# Altium schematic sheet Buzzer.SchDoc
size A
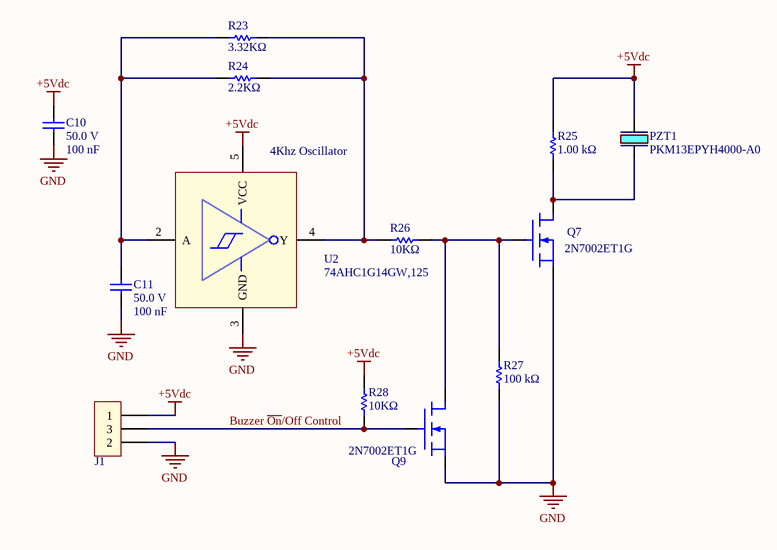
[diagram p0: Buzzer.SchDoc]

## Parts
C10  Voltage Rating (DC): 50.0 V  Capacitance: 100 nF  [Cap,0805]  (hidden comment: 08055C104JAT2A)
C11  Voltage Rating (DC): 50.0 V  Capacitance: 100 nF  [Cap,0805]  (hidden comment: 08055C104JAT2A)
J1  Generic Header  [Header,3POS,0.1",RA]  (value not drawn)
PZT1  PKM13EPYH4000-A0  [Buzzer,PKM13EPYH4000-A0]
Q7  2N7002ET1G  [SOT23-3]
Q9  2N7002ET1G  [SOT23-3]
R23  Resistance: 3.32KΩ  [res, 0805, HD]  (hidden comment: CRCW08053K32FKEA)
R24  Resistance: 2.2KΩ  [res, 0805, HD]  (hidden comment: CRCW08052K20FKEA)
R25  Resistance: 1.00 kΩ  [res, 0805, HD]  (hidden comment: Vishay CRCW08051K00JNEA)
R26  Resistance: 10KΩ  [res, 0805, HD]  (hidden comment: Vishay / Dale CRCW080510K0FKTA)
R27  Resistance: 100 kΩ  [res, 0805, HD]  (hidden comment: CRCW0805100KFKEA)
R28  Resistance: 10KΩ  [res, 0805, HD]  (hidden comment: Vishay / Dale CRCW080510K0FKTA)
U2  74AHC1G14GW,125  [SOT23-5]

## Nets
+5Vdc: C10.2 J1.1 PZT1.2 R25.1 R28.1 U2.5(VCC)
GND: C10.1 C11.2 J1.2 Q7.2(S) Q9.2(S) R27.2 U2.3(GND)
Buzzer ~{On}/Off Control: J1.3 Q9.1(G) R28.2
NetC11_1: C11.1 R23.2 R24.2 U2.2(A)
NetPZT1_1: PZT1.1 Q7.3(D) R25.2
NetQ7_1: Q7.1(G) Q9.3(D) R26.1 R27.1
NetR23_1: R23.1 R24.1 R26.2 U2.4(Y)

Not connected (* = marked no-connect by the designer): U2 1(N/C)

## Notes on the sheet
- (near U2) 4Khz Oscillator

## Library data of the parts
C10 C11 = Cap,0805,100nf,50V,5%,08055C104JAT2A: Capacitor; Ceramic; Cap 0.1 uF; Tol 5%; Vol-Rtg 50 VDC; SMT; 0805; X7R; Tape & Reel; Lead-Free Status: Lead Free; Case/Package (SI): 2012; Insulation Resistance: 100 GΩ; Detailed Description: 0.1µF ±5% 50V Ceramic Capacitor X7R 0805 (2012 Metric); Mounting Style: Surface Mount; Packaging: Tape & Reel (TR), Cut Tape (CT); RoHS: Compliant; Size-Width: 1.24 mm; Case/Package: 0805; Number of Pins: 2; digikey url: http://www.digikey.ca/product-detail/en/avx-corporation/08055C104JAT2A/478-3352-1-ND/930144; REACH SVHC Compliance: No SVHC; Dielectric Characteristic: X7R; Capacitance Tolerance: ±5%; Size-Length: 2.01 mm; Size-Height: 710 µm; Size-Thickness: 940 µm; Manufacturer Part Number: 08055C104JAT2A; Octopart URL: http://octopart.com/08055c104jat2a-avx-55388010; Operating Temperature: -55°C ~ 125°C; Supplier 1: Digi-Key; Supplier Part Number 1: 478-3352-1-ND
J1 = Header 1x3,0.1",TH,Generic: Generic Header 3 pos header 0.1"
PZT1 = Buzzer,PIEZO,30V,TH,4Khz,PKM13EPYH4000-A0: AUDIO PIEZO TRANSDUCER 30V TH; Manufacturer: Murata Electronics; Detailed Description: Buzzers Transducer, Externally Driven Piezo 1.5 V - 4kHz 70dB @ 1.5V, 10cm Through Hole PC Pins; Driver Circuitry: Transducer, Externally Driven; Input Type: Zero-Peak Signal; Voltage Range: 30V (Max); Frequency: 4kHz; Operating Mode: Ringer; Sound Pressure Level (SPL): 70dB @ 1.5V, 10cm; Port Location: Top; Voltage - Rated: 1.5 V; mfg P/N: PKM13EPYH4000-A0; Category: Audio Products  Alarms, Buzzers, and Sirens; Series: PK; Part Status: Active; Technology: Piezo; Operating Temperature: -40°C ~ 85°C; Mounting Type: Through Hole; Termination: PC Pins; Size / Dimension: 0.496" Dia (12.60mm); Height - Seated (Max): 0.291" (7.40mm); Base Product Number: PKM13EPY; Supplier 1: Mouser; Supplier Part Number 1: 81-PKM13EPYH4000-A0; Supplier 2: Arrow Electronics; Supplier Part Number 2: PKM13EPYH4000-A0; Supplier 3: Digi-Key; Supplier Part Number 3: 490-4698-1-ND
Q7 Q9 = MOSFET,N-Channel,SOT23,0.25A,60V,2N7002ET1G: Small Signal MOSFET, 60 V, 310 mA, Single, N-Channel, 3-Pin SOT-23, Pb-Free, Tape and Reel; Manufacturer: ON Semiconductor; Continuous Drain Current (Ids): 0.25A; Lead-Free Status: Lead Free; Drain to Source Voltage (Vds): 60.0 V; Power Dissipation (Max): 350mW (Ta); REACH SVHC Compliance: No SVHC; Number of Pins: 3; Halogen Free Status: Halogen Free; Case/Package: SOT-23-3; Polarity: N-Channel; RoHS: Compliant; Lifecycle Status: Active; Supplier 1: Digi-Key; Supplier Part Number 1: 2N7002ET1GOSCT-ND; Supplier 2: LCSC; Supplier Part Number 2: C71533; Manufacturer Part Number: 2N7002ET1G
R23 = Res,0805,3.32K,±1%,100.0 ppm/°C,150.0 V,CRCW08053K32FKEA: RES SMD 3.32K OHM 1% 1/8W 0805; Case/Package (SI): 2012; Lead-Free Status: Lead Free; Power Rating: 0.125 W; Voltage Rating (DC): 150.0 V; Case/Package: 0805; Mounting Style: Surface Mount; Number of Pins: 2; REACH SVHC Compliance: No SVHC; Resistance Tolerance: ±1%; RoHS: Compliant; Size-Height: 0.00045 m; Size-Length: 0.002 m; Size-Width: 0.00125 m; Temperature Coefficient: 100.0 ppm/°C; mfg P/N: CRCW08053K32FKEA; Supplier 1: Digi-Key; Supplier Part Number 1: 541-3.32KCCT-ND
R24 = Res,0805,2.2KΩ,±1%,100.0 ppm/°C,150.0 V,CRCW08052K20FKEA: RES SMD 2.2K OHM 1% 1/8W 0805; Case/Package (SI): 2012; Lead-Free Status: Lead Free; Power Rating: 0.125 W; Voltage Rating (DC): 150.0 V; Case/Package: 0805; Mounting Style: Surface Mount; Number of Pins: 2; REACH SVHC Compliance: No SVHC; Resistance Tolerance: ±1%; RoHS: Compliant; Size-Height: 0.00045 m; Size-Length: 0.002 m; Size-Width: 0.00125 m; Temperature Coefficient: 100.0 ppm/°C; mfg P/N: CRCW08052K20FKEA; Supplier 1: Digi-Key; Supplier Part Number 1: 541-2.20KCCT-ND
R25 = Res,0805,1.00 kΩ,5%,200ppm,CRCW08051K00JNEA: Res Thick Film 0805 1K Ohm 5% 0.125W(1/8W) ±200ppm/C Molded SMD Automotive Paper T/R; Power Rating: 125 mW; Case/Package (SI): 2012; Lead-Free Status: Lead Free; Temperature Coefficient: 200 ppm/°C; Voltage Rating (DC): 150 V; Size-Width: 1.25 mm; Mounting Style: Surface Mount; REACH SVHC Compliance: No SVHC; Manufacturer Part Number: CRCW08051K00JNEA; Number of Pins: 2; Size-Height: 450 µm; Packaging: Tape & Reel (TR), Cut Tape (CT); RoHS: Compliant; Resistance Tolerance: ±5%; Case/Package: 0805; Size-Length: 2.00 mm; Supplier 1: Digi-Key; Supplier Part Number 1: 541-1.0KADKR-ND; Supplier 2: Digi-Key; Supplier Part Number 2: 541-1.0KACT-ND
R26 R28 = Res,0805,10.0kΩ,1%,100 ppm,CRCW080510K0FKTA: RES SMD 10K OHM 1% 1/8W 0805; Temperature Coefficient: 100.0 ppm/C; Lead-Free Status: Contains Lead; Voltage Rating (DC): 150.0 V; Power Rating: 0.125 W; Case/Package (SI): 2012; Size-Width: 0.00125 m; Resistance Tolerance: 1%; Size-Length: 0.002 m; RoHS: Non-Compliant; Power Dissipation: 0.125 W; Number of Pins: 2; REACH SVHC Compliance: No SVHC; Size-Height: 0.00045 m; Case/Package: 0805; Mounting Style: Surface Mount; Supplier 1: Digi-Key; Supplier Part Number 1: 541-3016-1-ND
R27 = Res,0805,100kΩ,1%,100ppm,CRCW0805100KFKEA: 100 kOhms ±1% 0.125W, 1/8W Chip Resistor 0805 (2012 Metric) Thick Film; Manufacturer: Vishay; Lead-Free Status: Lead Free; Case/Package (SI): 2012; Power Rating: 125 mW; Temperature Coefficient: -100 ppm/°C to 100 ppm/°C; Resistance Tolerance: ±1%; RoHS: Compliant; Manufacturer Part Number: CRCW0805100KFKEA; Number of Pins: 2; Size-Length: 2.00 mm; Packaging: Tape & Reel (TR), Reel, Cut Tape (CT); Size-Height: 450 µm; Case/Package: 0805; Size-Width: 1.25 mm; Operating Temperature: 150 °C (max); Supplier 1 Part Number: 679-0803; Supplier 1: RS; Supplier 2: Digi-Key; Supplier Part Number 2: 541-100KCCT-ND
U2 = IC,Logic,Schmitt trigger INV,2V ~ 5.5V,5-TSSOP , 74AHC1G14GW,125: IC INVERTER SCHMITT 1CH 5TSSOP; Manufacturer: Nexperia USA Inc.; Detailed Description: Inverter IC 1 Channel Schmitt Trigger 5-TSSOP; Number of Inputs: 1; Current - Output High, Low: 8mA, 8mA; Logic Level - Low: 0.9V ~ 1.65V; Logic Level - High: 2.2V ~ 3.85V; Max Propagation Delay @ V, Max CL: 10.6ns @ 5V, 50pF; Current - Quiescent (Max): 1µA; mfg P/N: 74AHC1G14GW,125; Category: Integrated Circuits (ICs)  Logic - Gates and Inverters; Series: 74AHC; Part Status: Active; Logic Type: Inverter; Features: Schmitt Trigger; Voltage - Supply: 2V ~ 5.5V; Operating Temperature: -40°C ~ 125°C; Mounting Type: Surface Mount; Supplier Device Package: 5-TSSOP; Package / Case: 5-TSSOP, SC-70-5, SOT-353; Number of Circuits: 1; Supplier 1: Digi-Key; Supplier Part Number 1: 1727-3149-1-ND; Supplier 2: LCSC; Supplier Part Number 2: C282410